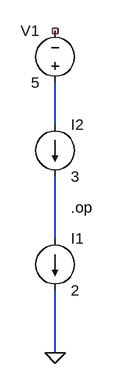
[diagram p0: schematic Q1a.asc]
Q1a.asc, the LTspice schematic file:
Version 4
SHEET 1 880 680
WIRE 400 224 400 160
WIRE 400 400 400 304
WIRE 400 576 400 480
FLAG 400 576 0
SYMBOL current 400 400 R0
SYMATTR InstName I1
SYMATTR Value 2
SYMBOL current 400 224 R0
SYMATTR InstName I2
SYMATTR Value 3
SYMBOL voltage 400 176 R180
WINDOW 0 24 96 Left 2
WINDOW 3 24 16 Left 2
SYMATTR InstName V1
SYMATTR Value 5
TEXT 424 352 Left 2 !.op

The netlist it stands for:
* Q1a.asc
I1 N002 0 2
I2 N001 N002 3
V1 N001 NC_01 5
.op
.backanno
.end